# EAGLE board Tyr (EAGLE 9.5.2), part 1 of 2
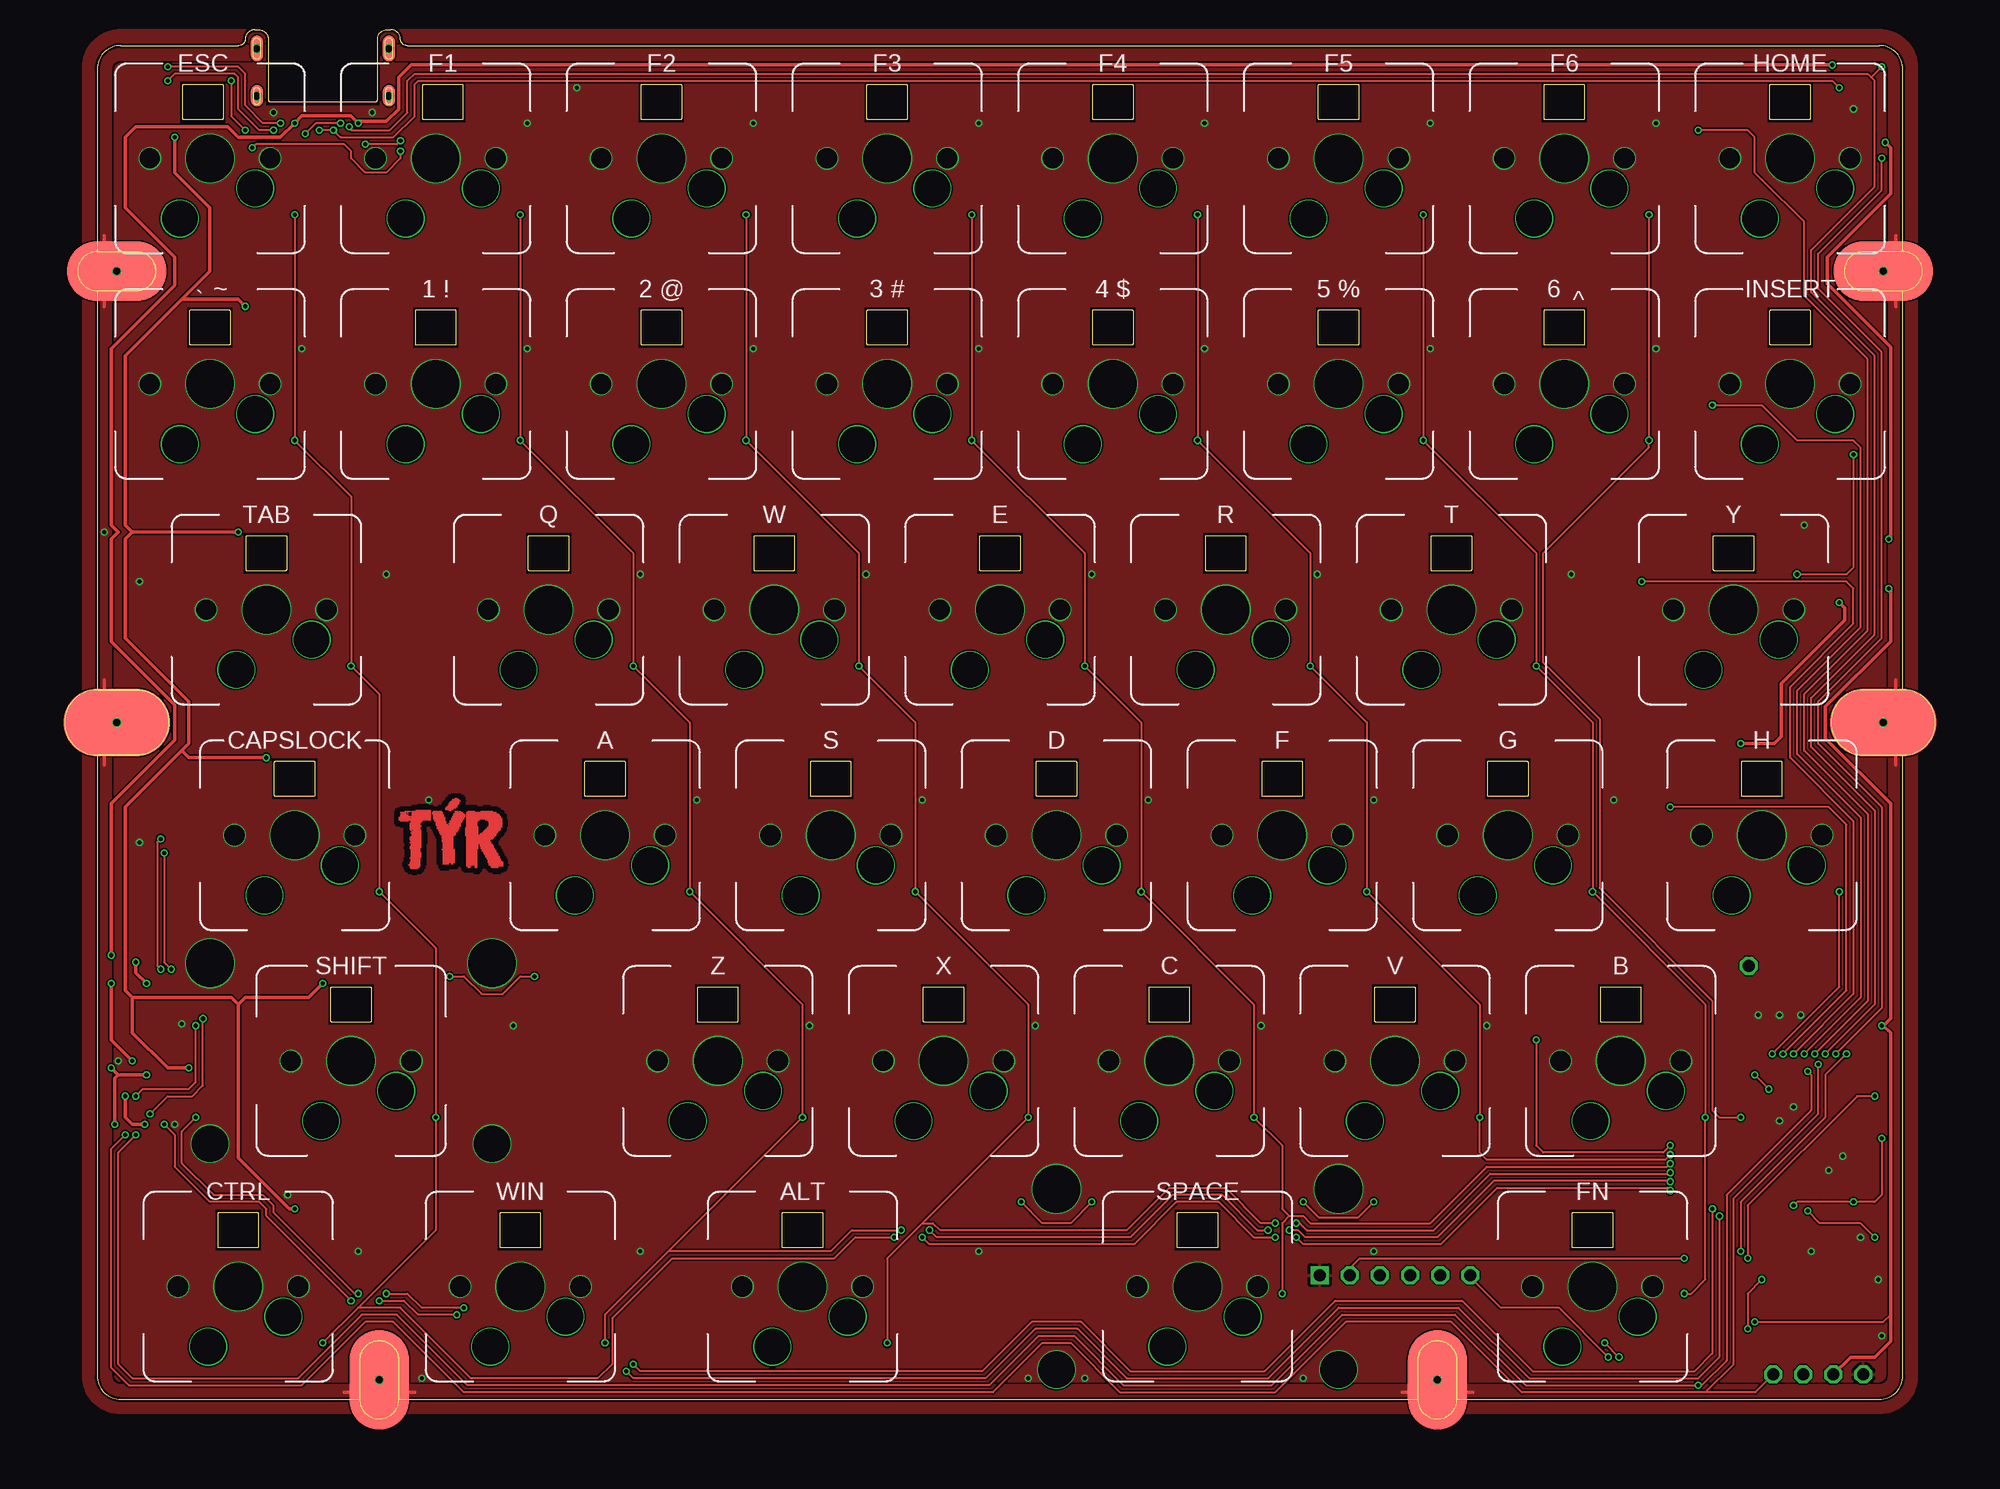
[diagram p3: board, top side]
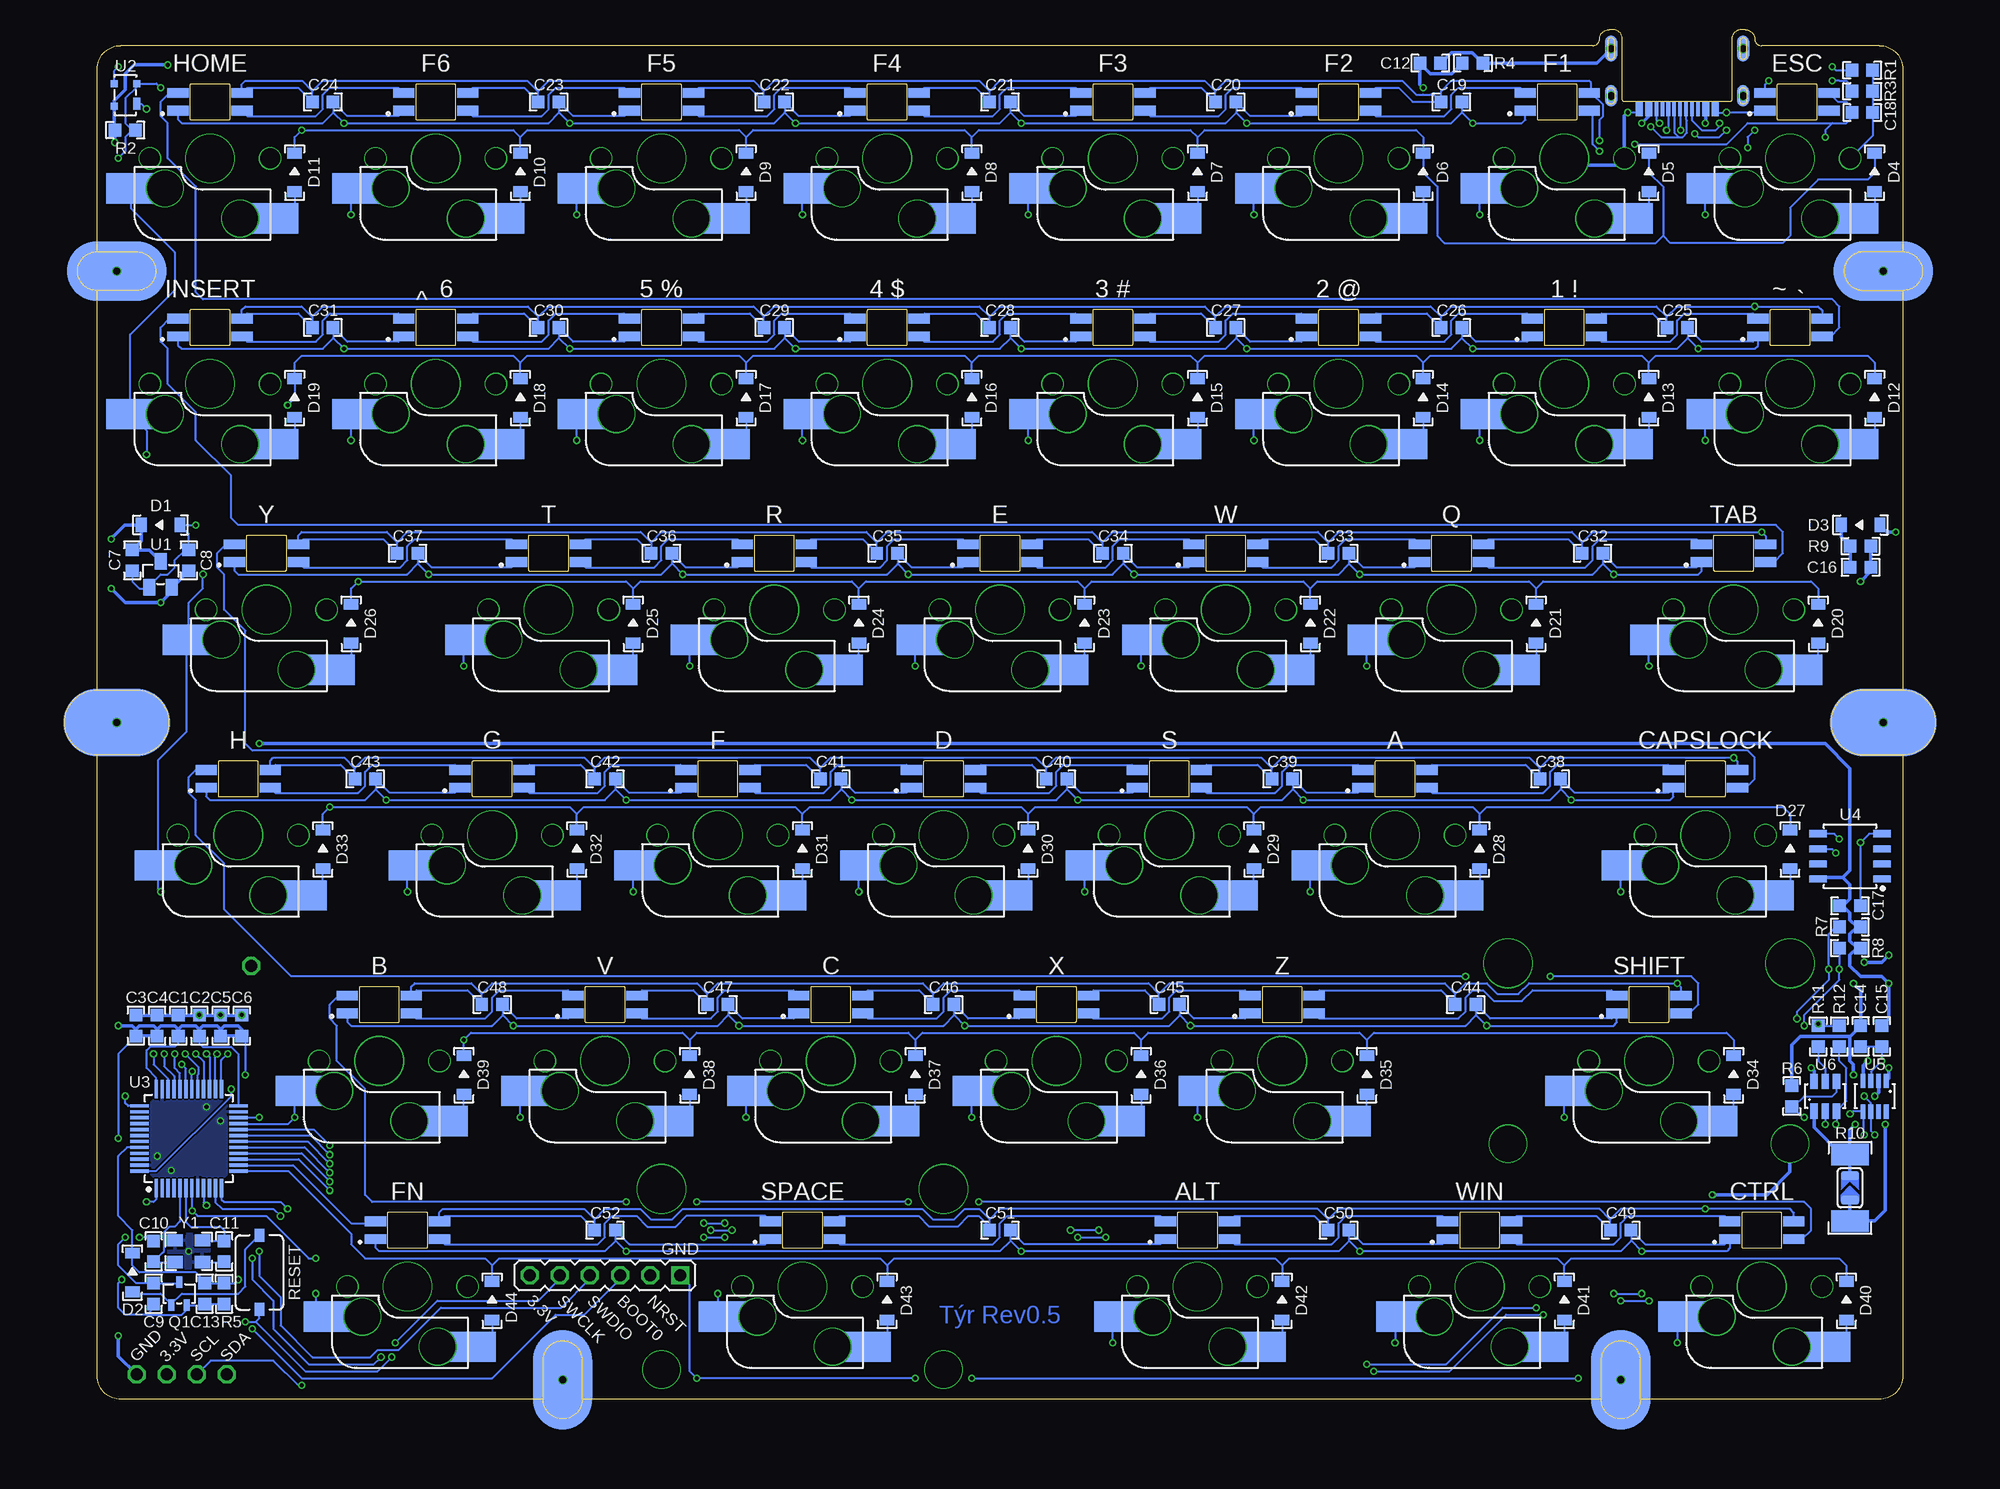
[diagram p4: board, bottom side, seen from below]

Size 152.4 x 115.64 mm. Coordinates in mm from the lower left corner, seen from the top.
Outline: 152.4,2 152.4,54.4 149.1,54.4 arc-90 146.35,57.15 arc-90 149.1,59.9 152.4,59.9 152.4,93.6 149.1,93.6 arc-90 147.45,95.25 arc-90 149.1,96.9 152.4,96.9 152.4,112.3 arc90 150.4,114.3 26.19,114.3 26.14,114.3 arc-90 25.6,114.84 arc90 24.8,115.64 24.46,115.64 arc90 23.66,114.84 23.66,109.74 arc-90 23.46,109.54 14.64,109.54 arc-90 14.44,109.74 14.44,114.84 arc90 13.64,115.64 13.3,115.64 arc90 12.5,114.84 arc-90 11.96,114.3 11.91,114.3 2,114.3 arc90 0,112.3 0,96.9 3.3,96.9 arc-90 4.95,95.25 arc-90 3.3,93.6 0,93.6 0,59.9 3.3,59.9 arc-90 6.05,57.15 arc-90 3.3,54.4 0,54.4 0,2 arc90 2,0 22.16,0 22.16,3.3 arc-90 23.81,4.95 arc-90 25.46,3.3 25.46,0 111.46,0 111.46,3.3 arc-90 113.11,4.95 arc-90 114.76,3.3 114.76,0 150.4,0 arc90 152.4,2
Copper layers (1*16): Top 0.035559375mm / dielectric 1.6mm / Bottom 0.035559375mm
Design rules "oshpark-2layer *": minimum track width 5mil, minimum drill 10mil, track to track 5mil, track to pad 6mil, pad to pad 6mil, via to via 6mil, smd to smd 6mil, copper to edge 8mil, drill to drill 6mil, minimum pad ring 3mil, minimum via ring 5mil, stop-mask expansion 2.5mil, vias tented up to drill 20mil, thermal gap 10mil
tRestrict: area 14.3,109.2 to 23.8,115.8
bRestrict: area 14.3,109.2 to 23.8,115.8

## Footprints (pad centres in the part's own frame; a part is rotated, then mirrored left to right if it is on the bottom)
C0603 = smd 1.05 x 1.08: 1 -0.875,0; 2 0.875,0
SOD-123 = smd 0.91 x 1.22: A -1.635,0; C 1.635,0
HOLE_5MM_OVAL = smd 9 x 5.7 bottom: P$1 0,0 | smd 9 x 5.7: P$2 0,0 | drill 0.6: P$3 0,0
HOLE_M3_OVAL = smd 8.4 x 5 bottom: P$1 0,0 | smd 8.4 x 5: P$2 0,0 | drill 0.6: P$3 0,0
TYR_TYR_DISPLAY = drill 1.016 pad 1.524 octagon: 3.3V 1.288,36.6; GND 10.954,2.1; SCL 5.874,2.1; SDA 3.334,2.1; VIN 8.414,2.1
WS2812B_3528_REVERS-MOUNT = smd 1.8 x 0.82: DIN -2.7,0.75; DOUT 2.7,-0.75; GND -2.7,-0.75; VDD 2.7,0.75
1X06 = drill 1.016 pad 1.524 square: 1 -6.35,0 | drill 1.016 pad 1.524 octagon: 2 -3.81,0; 3 -1.27,0; 4 1.27,0; 5 3.81,0; 6 6.35,0
SOT-323 = smd 0.988 x 0.51: 1 -0.97,0.65; 2 -0.97,-0.65; 3 0.97,0
R0603 = smd 1.05 x 1.08: 1 -0.875,0; 2 0.875,0
R2512 = smd 1.8 x 3.2: 1 -2.8,0; 2 2.8,0
SOLDERJUMPER_ARROW_NOPASTE = smd 0.762 x 1.524: 1 -1.016,0; 2 1.016,0
BUTTON_3*6*2.5 = smd 1.1 x 0.8: P$1 -3.125,0; P$2 3.125,0
MX-1U-HOTSWAP = drill 4 pad 4.2: HOLE1 0,0 | drill 3 pad 3.2: HOLE2 2.54,5.08; HOLE3 -3.81,2.54 | drill 1.7 pad 1.9: HOLE4 -5.08,0; HOLE5 5.08,0 | smd 4 x 2.55 bottom: P$1 -6.735,2.54; P$2 5.465,5.08
MX-1U-HOTSWAP-CAPSLOCK = drill 4 pad 4.2: HOLE1 0,0 | drill 3 pad 3.2: HOLE2 2.54,5.08; HOLE3 -3.81,2.54 | drill 1.7 pad 1.9: HOLE4 -5.08,0; HOLE5 5.08,0 | smd 4 x 2.55 bottom: P$1 -6.735,2.54; P$2 5.465,5.08
MX-2U-HOTSWAP = drill 4 pad 4.2: HOLE1 0,0; HOLE6 -11.9,-8.24; HOLE7 11.9,-8.24 | drill 3 pad 3.2: HOLE2 2.54,5.08; HOLE3 -3.81,2.54 | drill 1.7 pad 1.9: HOLE4 -5.08,0; HOLE5 5.08,0 | drill 3.05 pad 3.25: HOLE8 -11.9,7; HOLE9 11.9,7 | smd 4 x 2.55 bottom: P$1 -6.735,2.54; P$2 5.465,5.08
SOT-23 = smd 1 x 1.4: 1 -0.95,-1.1; 2 0.95,-1.1; 3 0,1.1
PRTR5V0U2X = smd 1 x 0.6: 1 -0.75,-0.95 | smd 0.6 x 0.6: 2 0.95,-0.95; 3 0.95,0.95; 4 -0.95,0.95
LQFP48 = smd 1.559 x 0.28: 1 -4.178,2.75; 2 -4.178,2.25; 3 -4.178,1.75; 4 -4.178,1.25; 5 -4.178,0.75; 6 -4.178,0.25; 7 -4.178,-0.25; 8 -4.178,-0.75; 9 -4.178,-1.25; 10 -4.178,-1.75; 11 -4.178,-2.25; 12 -4.178,-2.75; 25 4.178,-2.75; 26 4.178,-2.25; 27 4.178,-1.75; 28 4.178,-1.25; 29 4.178,-0.75; 30 4.178,-0.25; 31 4.178,0.25; 32 4.178,0.75; 33 4.178,1.25; 34 4.178,1.75; 35 4.178,2.25; 36 4.178,2.75 | smd 0.28 x 1.559: 13 -2.75,-4.178; 14 -2.25,-4.178; 15 -1.75,-4.178; 16 -1.25,-4.178; 17 -0.75,-4.178; 18 -0.25,-4.178; 19 0.25,-4.178; 20 0.75,-4.178; 21 1.25,-4.178; 22 1.75,-4.178; 23 2.25,-4.178; 24 2.75,-4.178; 37 2.75,4.178; 38 2.25,4.178; 39 1.75,4.178; 40 1.25,4.178; 41 0.75,4.178; 42 0.25,4.178; 43 -0.25,4.178; 44 -0.75,4.178; 45 -1.25,4.178; 46 -1.75,4.178; 47 -2.25,4.178; 48 -2.75,4.178
SOP-8 = smd 1.485 x 0.615: 1 -2.715,1.905; 2 -2.715,0.635; 3 -2.715,-0.635; 4 -2.715,-1.905; 5 2.715,-1.905; 6 2.715,-0.635; 7 2.715,0.635; 8 2.715,1.905
SOT23-8 = smd 0.4 x 1.2: 1 -0.975,-1.3; 2 -0.325,-1.3; 3 0.325,-1.3; 4 0.975,-1.3; 5 0.975,1.3; 6 0.325,1.3; 7 -0.325,1.3; 8 -0.975,1.3
SOT-23-6P = smd 1.3 x 0.6: 1 -1.25,0.95; 2 -1.25,0; 3 -1.25,-0.95; 4 1.25,-0.95; 5 1.25,0; 6 1.25,0.95
USB-C-12P-INBOARD = smd 0.3 x 1.15: CC1 -1.25,3; CC2 1.75,3; DN1 0.25,3; DN2 -0.75,3; DP1 -0.25,3; DP2 0.75,3; SBU1 -1.75,3; SBU2 1.25,3 | smd 0.6 x 1.15: GND1 -3.2,3; GND2 3.2,3; VBUS1 -2.4,3; VBUS2 2.4,3 | smd 1 x 1.8: P$1 -5.575,1.875; P$2 5.575,1.875 | smd 1 x 1.8 bottom: P$3 -5.575,1.875; P$4 5.575,1.875 | smd 1 x 2.2: P$5 -5.575,-2.125; P$6 5.575,-2.125 | drill 0.6 pad 0.8: P$7 -5.575,1.875; P$10 5.575,1.875; P$11 -5.575,-2.125; P$12 5.575,-2.125 | smd 1 x 2.2 bottom: P$8 -5.575,-2.125; P$9 5.575,-2.125
CRYSTAL-3.2X2.5 = smd 1.3 x 1.05: 1 -1.15,-0.925; 2 1.15,-0.925; 3 1.15,0.925; 4 -1.15,0.925

## Placement (x,y rotation side)
C1  100n  [C0603]  145.55,31.55 90 bottom
C2  100n  [C0603]  143.77,31.55 90 bottom
C3  10n  [C0603]  149.13,31.55 90 bottom
C4  1u  [C0603]  147.34,31.55 90 bottom
C5  100n  [C0603]  141.98,31.55 90 bottom
C6  4.7u  [C0603]  140.2,31.55 90 bottom
C7  1u  [C0603]  149.42,70.84 90 bottom
C8  1u  [C0603]  144.66,70.84 270 bottom
C9  4.7n  [C0603]  147.64,8.93 270 bottom
C10  22p  [C0603]  147.64,12.5 270 bottom
C11  22p  [C0603]  141.68,12.5 90 bottom
C12  4.7u  [C0603]  39.89,112.81 180 bottom
C13  10u  [C0603]  143.32,8.93 90 bottom
C14  0.1u  [C0603]  3.57,30.66 90 bottom
C15  0.1u  [C0603]  1.79,30.66 90 bottom
C16  4.7u  [C0603]  3.57,70.25 0 bottom
C17  10u  [C0603]  4.46,41.67 180 bottom
C18  100n  [C0603]  3.42,108.64 180 bottom
C19  100n  [C0603]  38.1,109.54 180 bottom
C20  100n  [C0603]  57.15,109.54 180 bottom
C21  100n  [C0603]  76.2,109.54 180 bottom
C22  100n  [C0603]  95.25,109.54 180 bottom
C23  100n  [C0603]  114.3,109.54 180 bottom
C24  100n  [C0603]  133.35,109.54 180 bottom
C25  100n  [C0603]  19.05,90.49 180 bottom
C26  100n  [C0603]  38.1,90.49 180 bottom
C27  100n  [C0603]  57.15,90.49 180 bottom
C28  100n  [C0603]  76.2,90.49 180 bottom
C29  100n  [C0603]  95.25,90.49 180 bottom
C30  100n  [C0603]  114.3,90.49 180 bottom
C31  100n  [C0603]  133.35,90.49 180 bottom
C32  100n  [C0603]  26.19,71.44 180 bottom
C33  100n  [C0603]  47.62,71.44 180 bottom
C34  100n  [C0603]  66.67,71.44 180 bottom
C35  100n  [C0603]  85.72,71.44 180 bottom
C36  100n  [C0603]  104.78,71.44 180 bottom
C37  100n  [C0603]  126.21,71.44 180 bottom
C38  100n  [C0603]  29.77,52.39 180 bottom
C39  100n  [C0603]  52.39,52.39 180 bottom
C40  100n  [C0603]  71.44,52.39 180 bottom
C41  100n  [C0603]  90.49,52.39 180 bottom
C42  100n  [C0603]  109.54,52.39 180 bottom
C43  100n  [C0603]  129.78,52.39 180 bottom
C44  100n  [C0603]  36.91,33.34 180 bottom
C45  100n  [C0603]  61.91,33.34 180 bottom
C46  100n  [C0603]  80.96,33.34 180 bottom
C47  100n  [C0603]  100.01,33.34 180 bottom
C48  100n  [C0603]  119.06,33.34 180 bottom
C49  100n  [C0603]  23.81,14.29 180 bottom
C50  100n  [C0603]  47.62,14.29 180 bottom
C51  100n  [C0603]  76.2,14.29 180 bottom
C52  100n  [C0603]  109.54,14.29 180 bottom
D1  DIODE_SCHOTTKY  [SOD-123]  147.04,73.82 180 bottom
D2  1N4148  [SOD-123]  149.42,10.72 90 bottom
D3  1N4148  [SOD-123]  3.57,73.82 180 bottom
D4  1N4148  [SOD-123]  2.38,103.58 90 bottom
D5  1N4148  [SOD-123]  21.43,103.58 90 bottom
D6  1N4148  [SOD-123]  40.48,103.58 90 bottom
D7  1N4148  [SOD-123]  59.53,103.58 90 bottom
D8  1N4148  [SOD-123]  78.58,103.58 90 bottom
D9  1N4148  [SOD-123]  97.63,103.58 90 bottom
D10  1N4148  [SOD-123]  116.68,103.58 90 bottom
D11  1N4148  [SOD-123]  135.73,103.58 90 bottom
D12  1N4148  [SOD-123]  2.38,84.53 90 bottom
D13  1N4148  [SOD-123]  21.43,84.53 90 bottom
D14  1N4148  [SOD-123]  40.48,84.53 90 bottom
D15  1N4148  [SOD-123]  59.53,84.53 90 bottom
D16  1N4148  [SOD-123]  78.58,84.53 90 bottom
D17  1N4148  [SOD-123]  97.63,84.53 90 bottom
D18  1N4148  [SOD-123]  116.68,84.53 90 bottom
D19  1N4148  [SOD-123]  135.73,84.53 90 bottom
D20  1N4148  [SOD-123]  7.14,65.48 90 bottom
D21  1N4148  [SOD-123]  30.96,65.48 90 bottom
D22  1N4148  [SOD-123]  50.01,65.48 90 bottom
D23  1N4148  [SOD-123]  69.06,65.48 90 bottom
D24  1N4148  [SOD-123]  88.11,65.48 90 bottom
D25  1N4148  [SOD-123]  107.16,65.48 90 bottom
D26  1N4148  [SOD-123]  130.97,65.48 90 bottom
D27  1N4148  [SOD-123]  9.53,46.43 90 bottom
D28  1N4148  [SOD-123]  35.72,46.43 90 bottom
D29  1N4148  [SOD-123]  54.77,46.43 90 bottom
D30  1N4148  [SOD-123]  73.82,46.43 90 bottom
D31  1N4148  [SOD-123]  92.87,46.43 90 bottom
D32  1N4148  [SOD-123]  111.92,46.43 90 bottom
D33  1N4148  [SOD-123]  133.35,46.43 90 bottom
D34  1N4148  [SOD-123]  14.29,27.38 90 bottom
D35  1N4148  [SOD-123]  45.24,27.38 90 bottom
D36  1N4148  [SOD-123]  64.29,27.38 90 bottom
D37  1N4148  [SOD-123]  83.34,27.38 90 bottom
D38  1N4148  [SOD-123]  102.39,27.38 90 bottom
D39  1N4148  [SOD-123]  121.44,27.38 90 bottom
D40  1N4148  [SOD-123]  4.76,8.33 90 bottom
D41  1N4148  [SOD-123]  28.57,8.33 90 bottom
D42  1N4148  [SOD-123]  52.39,8.33 90 bottom
D43  1N4148  [SOD-123]  85.72,8.33 90 bottom
D44  1N4148  [SOD-123]  119.06,8.33 90 bottom
HOLE1  MOUNT_HOLE-5MM_NOTCH  [HOLE_5MM_OVAL]  150.75,57.15 0 top
HOLE2  MOUNT_HOLE-5MM_NOTCH  [HOLE_5MM_OVAL]  1.65,57.15 0 top
HOLE3  MOUNT_HOLE  [HOLE_M3_OVAL]  23.81,1.65 90 top
HOLE4  MOUNT_HOLE  [HOLE_M3_OVAL]  1.65,95.25 0 top
HOLE5  MOUNT_HOLE  [HOLE_M3_OVAL]  150.75,95.25 0 top
HOLE6  MOUNT_HOLE  [HOLE_M3_OVAL]  113.11,1.65 90 top
J1  TYR_DISPLAY  [TYR_TYR_DISPLAY]  138.11,0 0 top
LED1  WS2812B_3528_REVERS-MOUNT  [WS2812B_3528_REVERS-MOUNT]  8.93,109.54 0 bottom
LED2  WS2812B_3528_REVERS-MOUNT  [WS2812B_3528_REVERS-MOUNT]  29.17,109.54 0 bottom
LED3  WS2812B_3528_REVERS-MOUNT  [WS2812B_3528_REVERS-MOUNT]  47.62,109.54 0 bottom
LED4  WS2812B_3528_REVERS-MOUNT  [WS2812B_3528_REVERS-MOUNT]  66.67,109.54 0 bottom
LED5  WS2812B_3528_REVERS-MOUNT  [WS2812B_3528_REVERS-MOUNT]  85.72,109.54 0 bottom
LED6  WS2812B_3528_REVERS-MOUNT  [WS2812B_3528_REVERS-MOUNT]  104.78,109.54 0 bottom
LED7  WS2812B_3528_REVERS-MOUNT  [WS2812B_3528_REVERS-MOUNT]  123.83,109.54 0 bottom
LED8  WS2812B_3528_REVERS-MOUNT  [WS2812B_3528_REVERS-MOUNT]  142.88,109.54 0 bottom
LED9  WS2812B_3528_REVERS-MOUNT  [WS2812B_3528_REVERS-MOUNT]  9.53,90.49 0 bottom
LED10  WS2812B_3528_REVERS-MOUNT  [WS2812B_3528_REVERS-MOUNT]  28.57,90.49 0 bottom
LED11  WS2812B_3528_REVERS-MOUNT  [WS2812B_3528_REVERS-MOUNT]  47.62,90.49 0 bottom
LED12  WS2812B_3528_REVERS-MOUNT  [WS2812B_3528_REVERS-MOUNT]  66.67,90.49 0 bottom
LED13  WS2812B_3528_REVERS-MOUNT  [WS2812B_3528_REVERS-MOUNT]  85.72,90.49 0 bottom
LED14  WS2812B_3528_REVERS-MOUNT  [WS2812B_3528_REVERS-MOUNT]  104.78,90.49 0 bottom
LED15  WS2812B_3528_REVERS-MOUNT  [WS2812B_3528_REVERS-MOUNT]  123.83,90.49 0 bottom
LED16  WS2812B_3528_REVERS-MOUNT  [WS2812B_3528_REVERS-MOUNT]  142.88,90.49 0 bottom
LED17  WS2812B_3528_REVERS-MOUNT  [WS2812B_3528_REVERS-MOUNT]  14.29,71.44 0 bottom
LED18  WS2812B_3528_REVERS-MOUNT  [WS2812B_3528_REVERS-MOUNT]  38.1,71.44 0 bottom
LED19  WS2812B_3528_REVERS-MOUNT  [WS2812B_3528_REVERS-MOUNT]  57.15,71.44 0 bottom
LED20  WS2812B_3528_REVERS-MOUNT  [WS2812B_3528_REVERS-MOUNT]  76.2,71.44 0 bottom
LED21  WS2812B_3528_REVERS-MOUNT  [WS2812B_3528_REVERS-MOUNT]  95.25,71.44 0 bottom
LED22  WS2812B_3528_REVERS-MOUNT  [WS2812B_3528_REVERS-MOUNT]  114.3,71.44 0 bottom
LED23  WS2812B_3528_REVERS-MOUNT  [WS2812B_3528_REVERS-MOUNT]  138.11,71.44 0 bottom
LED24  WS2812B_3528_REVERS-MOUNT  [WS2812B_3528_REVERS-MOUNT]  16.67,52.39 0 bottom
LED25  WS2812B_3528_REVERS-MOUNT  [WS2812B_3528_REVERS-MOUNT]  42.86,52.39 0 bottom
LED26  WS2812B_3528_REVERS-MOUNT  [WS2812B_3528_REVERS-MOUNT]  61.91,52.39 0 bottom
LED27  WS2812B_3528_REVERS-MOUNT  [WS2812B_3528_REVERS-MOUNT]  80.96,52.39 0 bottom
LED28  WS2812B_3528_REVERS-MOUNT  [WS2812B_3528_REVERS-MOUNT]  100.01,52.39 0 bottom
LED29  WS2812B_3528_REVERS-MOUNT  [WS2812B_3528_REVERS-MOUNT]  119.06,52.39 0 bottom
LED30  WS2812B_3528_REVERS-MOUNT  [WS2812B_3528_REVERS-MOUNT]  140.49,52.39 0 bottom
LED31  WS2812B_3528_REVERS-MOUNT  [WS2812B_3528_REVERS-MOUNT]  21.43,33.34 0 bottom
LED32  WS2812B_3528_REVERS-MOUNT  [WS2812B_3528_REVERS-MOUNT]  52.39,33.34 0 bottom
LED33  WS2812B_3528_REVERS-MOUNT  [WS2812B_3528_REVERS-MOUNT]  71.44,33.34 0 bottom
LED34  WS2812B_3528_REVERS-MOUNT  [WS2812B_3528_REVERS-MOUNT]  90.49,33.34 0 bottom
LED35  WS2812B_3528_REVERS-MOUNT  [WS2812B_3528_REVERS-MOUNT]  109.54,33.34 0 bottom
LED36  WS2812B_3528_REVERS-MOUNT  [WS2812B_3528_REVERS-MOUNT]  128.59,33.34 0 bottom
LED37  WS2812B_3528_REVERS-MOUNT  [WS2812B_3528_REVERS-MOUNT]  11.91,14.29 0 bottom
LED38  WS2812B_3528_REVERS-MOUNT  [WS2812B_3528_REVERS-MOUNT]  35.72,14.29 0 bottom
LED39  WS2812B_3528_REVERS-MOUNT  [WS2812B_3528_REVERS-MOUNT]  59.53,14.29 0 bottom
LED40  WS2812B_3528_REVERS-MOUNT  [WS2812B_3528_REVERS-MOUNT]  92.87,14.29 0 bottom
LED41  WS2812B_3528_REVERS-MOUNT  [WS2812B_3528_REVERS-MOUNT]  126.21,14.29 0 bottom
LOGO1  LOGO_TYR  [LOGO_TYR_COPPER]  29.58,47.58 0 top
PH1  PINHEADER_1X6  [1X06]  109.54,10.48 180 bottom
Q1  DTC123J  [SOT-323]  145.48,8.93 90 bottom
R1  5.1k  [R0603]  3.42,112.22 0 bottom
R2  1.5k  [R0603]  150.02,107.16 0 bottom
R3  5.1k  [R0603]  3.42,110.43 0 bottom
R4  1M  [R0603]  36.31,112.81 180 bottom
R5  100k  [R0603]  141.68,8.93 270 bottom
R6  100k  [R0603]  9.38,25.6 90 bottom
R7  10k  [R0603]  4.46,39.89 0 bottom
R8  10k  [R0603]  4.46,38.1 0 bottom
R9  1M  [R0603]  3.57,72.03 0 bottom
R10  0.1/1% (PT2512FK-070R1L)  [R2512]  4.46,17.86 90 bottom
R11  54.9k  [R0603]  7.14,30.66 270 bottom
R12  10k  [R0603]  5.36,30.66 270 bottom
SJ1  [SOLDERJUMPER_ARROW_NOPASTE]  4.46,17.86 90 bottom
SW1  BUTTON  [BUTTON_3*6*2.5]  138.71,10.72 270 bottom
SW2  MX  [MX-1U-HOTSWAP]  9.53,104.78 180 top
SW3  MX  [MX-1U-HOTSWAP]  28.57,104.78 180 top
SW4  MX  [MX-1U-HOTSWAP]  47.62,104.78 180 top
SW5  MX  [MX-1U-HOTSWAP]  66.67,104.78 180 top
SW6  MX  [MX-1U-HOTSWAP]  85.72,104.78 180 top
SW7  MX  [MX-1U-HOTSWAP]  104.78,104.78 180 top
SW8  MX  [MX-1U-HOTSWAP]  123.83,104.78 180 top
SW9  MX  [MX-1U-HOTSWAP]  142.88,104.78 180 top
SW10  MX  [MX-1U-HOTSWAP]  9.53,85.72 180 top
SW11  MX  [MX-1U-HOTSWAP]  28.57,85.72 180 top
SW12  MX  [MX-1U-HOTSWAP]  47.62,85.72 180 top
SW13  MX  [MX-1U-HOTSWAP]  66.67,85.72 180 top
SW14  MX  [MX-1U-HOTSWAP]  85.72,85.72 180 top
SW15  MX  [MX-1U-HOTSWAP]  104.78,85.72 180 top
SW16  MX  [MX-1U-HOTSWAP]  123.83,85.72 180 top
SW17  MX  [MX-1U-HOTSWAP]  142.88,85.72 180 top
SW18  MX  [MX-1U-HOTSWAP]  14.29,66.67 180 top
SW19  MX  [MX-1U-HOTSWAP]  38.1,66.67 180 top
SW20  MX  [MX-1U-HOTSWAP]  57.15,66.67 180 top
SW21  MX  [MX-1U-HOTSWAP]  76.2,66.67 180 top
SW22  MX  [MX-1U-HOTSWAP]  95.25,66.67 180 top
SW23  MX  [MX-1U-HOTSWAP]  114.3,66.67 180 top
SW24  MX  [MX-1U-HOTSWAP]  138.11,66.67 180 top
SW25  MX  [MX-1U-HOTSWAP-CAPSLOCK]  16.67,47.62 180 top
SW26  MX  [MX-1U-HOTSWAP]  42.86,47.62 180 top
SW27  MX  [MX-1U-HOTSWAP]  61.91,47.62 180 top
SW28  MX  [MX-1U-HOTSWAP]  80.96,47.62 180 top
SW29  MX  [MX-1U-HOTSWAP]  100.01,47.62 180 top
SW30  MX  [MX-1U-HOTSWAP]  119.06,47.62 180 top
SW31  MX  [MX-1U-HOTSWAP]  140.49,47.62 180 top
SW32  MX  [MX-2U-HOTSWAP]  21.43,28.57 180 top
SW33  MX  [MX-1U-HOTSWAP]  52.39,28.57 180 top
SW34  MX  [MX-1U-HOTSWAP]  71.44,28.57 180 top
SW35  MX  [MX-1U-HOTSWAP]  90.49,28.57 180 top
SW36  MX  [MX-1U-HOTSWAP]  109.54,28.57 180 top
SW37  MX  [MX-1U-HOTSWAP]  128.59,28.57 180 top
SW38  MX  [MX-1U-HOTSWAP]  11.91,9.53 180 top
SW39  MX  [MX-1U-HOTSWAP]  35.72,9.53 180 top
SW40  MX  [MX-1U-HOTSWAP]  59.53,9.53 180 top
SW41  MX  [MX-2U-HOTSWAP]  92.87,9.53 180 top
SW42  MX  [MX-1U-HOTSWAP]  126.21,9.53 180 top
U1  MCP1700T  [SOT-23]  147.04,69.65 0 bottom
U2  PRTR5V0U2X  [PRTR5V0U2X]  150.02,110.13 90 bottom
U3  STM32F303CC  [LQFP48]  144.66,22.03 90 bottom
U4  MB85RC256V  [SOP-8]  4.46,45.84 180 bottom
U5  [SOT23-8]  2.38,25.6 180 bottom
U6  TPS2552  [SOT-23-6P]  6.55,25.6 90 bottom
X1  USB-C-12P-INBOARD  [USB-C-12P-INBOARD]  19.05,111.92 180 bottom
Y1  8Mhz  [CRYSTAL-3.2X2.5]  144.66,12.5 0 bottom